# EAGLE design K-Diag small- single_small-multi (EAGLE 6.5.0)

## Sheet 1 of 3
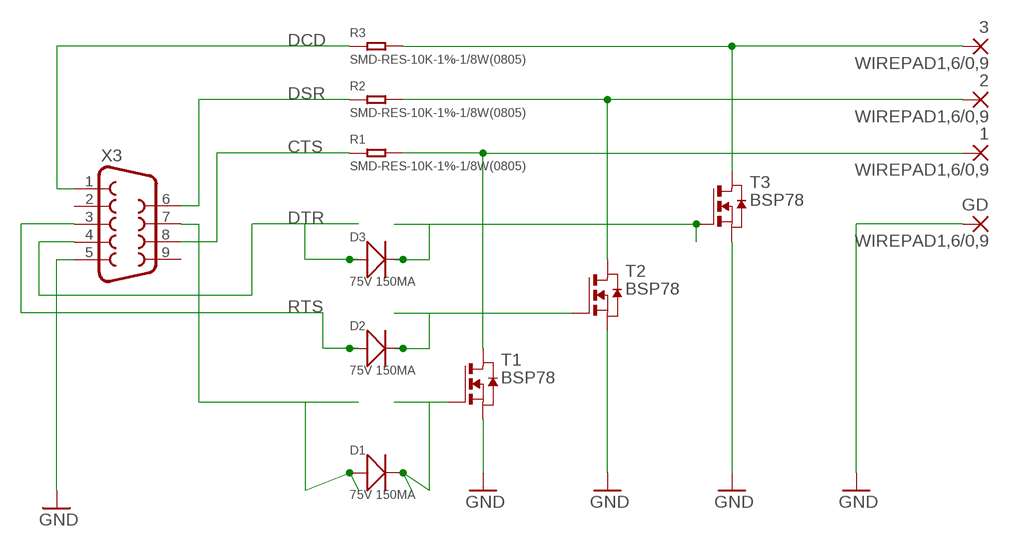
[diagram p0: schematic, sheet 1]

### Parts
1  WIREPAD1,6/0,9  [1,6/0,9]
2  WIREPAD1,6/0,9  [1,6/0,9]
3  WIREPAD1,6/0,9  [1,6/0,9]
D1  75V 150MA  SMD-DIODE-SWITCHING-75V-150MA(D1206)  [LED-1206]
D2  75V 150MA  SMD-DIODE-SWITCHING-75V-150MA(D1206)  [LED-1206]
D3  75V 150MA  SMD-DIODE-SWITCHING-75V-150MA(D1206)  [LED-1206]
GD  WIREPAD1,6/0,9  [1,6/0,9]
R1  SMD-RES-10K-1%-1/8W(0805)  [R0805]
R2  SMD-RES-10K-1%-1/8W(0805)  [R0805]
R3  SMD-RES-10K-1%-1/8W(0805)  [R0805]
T1  BSP78  NMOSSOT223  [SOT223]
T2  BSP78  NMOSSOT223  [SOT223]
T3  BSP78  NMOSSOT223  [SOT223]
X3  F09D  [F09D]

### Nets
CTS: R1.1 X3.8 ; also sheet 2,3
DCD: R3.1 X3.1 ; also sheet 2,3
DSR: R2.1 X3.6 ; also sheet 2,3
DTR: D3.+ X3.4 ; also sheet 2,3
GND: GD.1(P) T1.3(S) T2.3(S) T3.3(S) X3.5 ; also sheet 2,3
N$1: D3.- T3.1(G)
N$2: D2.- T2.1(G)
N$3: D1.- T1.1(G)
N$4: 1.1(P) R1.2 T1.2(D) T1.4(D)
N$5: 2.1(P) R2.2 T2.2(D) T2.4(D)
N$6: 3.1(P) R3.2 T3.2(D) T3.4(D)
N$7: D1.+ X3.7
RTS: D2.+ X3.3 ; also sheet 2,3
Unconnected: X3.2 X3.9

## Sheet 2 of 3
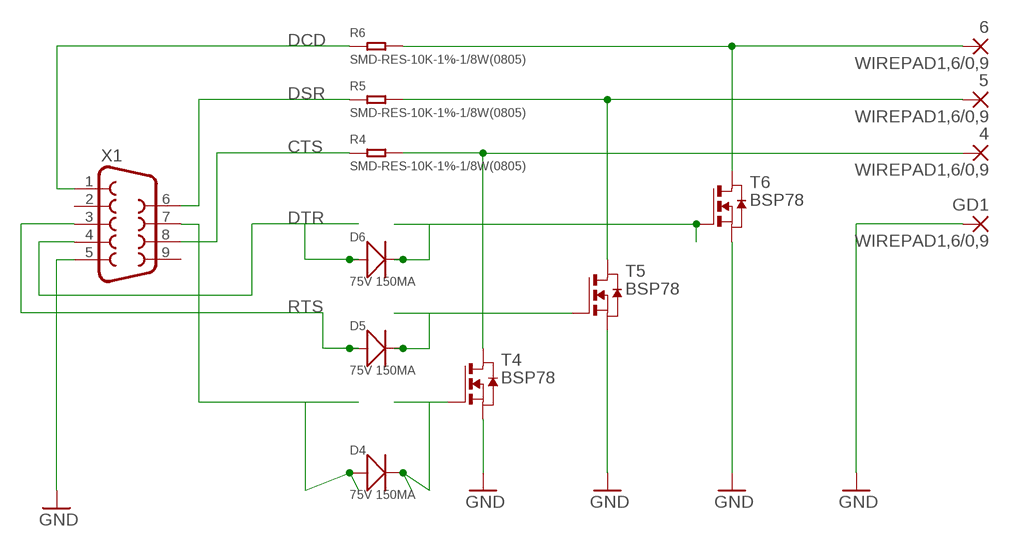
[diagram p1: schematic, sheet 2]

### Parts
4  WIREPAD1,6/0,9  [1,6/0,9]
5  WIREPAD1,6/0,9  [1,6/0,9]
6  WIREPAD1,6/0,9  [1,6/0,9]
D4  75V 150MA  SMD-DIODE-SWITCHING-75V-150MA(D1206)  [LED-1206]
D5  75V 150MA  SMD-DIODE-SWITCHING-75V-150MA(D1206)  [LED-1206]
D6  75V 150MA  SMD-DIODE-SWITCHING-75V-150MA(D1206)  [LED-1206]
GD1  WIREPAD1,6/0,9  [1,6/0,9]
R4  SMD-RES-10K-1%-1/8W(0805)  [R0805]
R5  SMD-RES-10K-1%-1/8W(0805)  [R0805]
R6  SMD-RES-10K-1%-1/8W(0805)  [R0805]
T4  BSP78  NMOSSOT223  [SOT223]
T5  BSP78  NMOSSOT223  [SOT223]
T6  BSP78  NMOSSOT223  [SOT223]
X1  F09D  [F09D]

### Nets
CTS: R4.1 X1.8 ; also sheet 1,3
DCD: R6.1 X1.1 ; also sheet 1,3
DSR: R5.1 X1.6 ; also sheet 1,3
DTR: D6.+ X1.4 ; also sheet 1,3
GND: GD1.1(P) T4.3(S) T5.3(S) T6.3(S) X1.5 ; also sheet 1,3
N$8: D6.- T6.1(G)
N$9: D5.- T5.1(G)
N$10: D4.- T4.1(G)
N$11: 4.1(P) R4.2 T4.2(D) T4.4(D)
N$12: 5.1(P) R5.2 T5.2(D) T5.4(D)
N$13: 6.1(P) R6.2 T6.2(D) T6.4(D)
N$14: D4.+ X1.7
RTS: D5.+ X1.3 ; also sheet 1,3
Unconnected: X1.2 X1.9

## Sheet 3 of 3
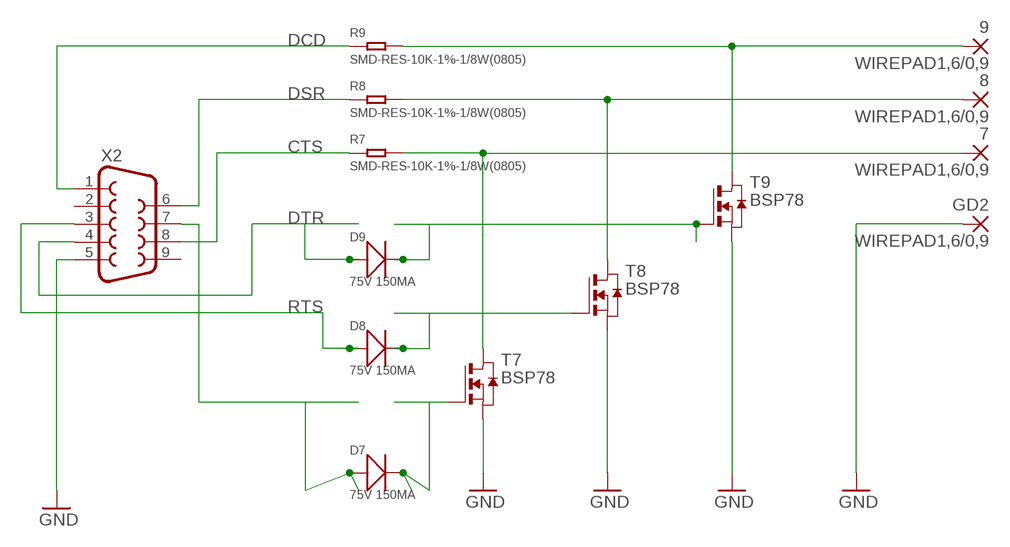
[diagram p2: schematic, sheet 3]

### Parts
7  WIREPAD1,6/0,9  [1,6/0,9]
8  WIREPAD1,6/0,9  [1,6/0,9]
9  WIREPAD1,6/0,9  [1,6/0,9]
D7  75V 150MA  SMD-DIODE-SWITCHING-75V-150MA(D1206)  [LED-1206]
D8  75V 150MA  SMD-DIODE-SWITCHING-75V-150MA(D1206)  [LED-1206]
D9  75V 150MA  SMD-DIODE-SWITCHING-75V-150MA(D1206)  [LED-1206]
GD2  WIREPAD1,6/0,9  [1,6/0,9]
R7  SMD-RES-10K-1%-1/8W(0805)  [R0805]
R8  SMD-RES-10K-1%-1/8W(0805)  [R0805]
R9  SMD-RES-10K-1%-1/8W(0805)  [R0805]
T7  BSP78  NMOSSOT223  [SOT223]
T8  BSP78  NMOSSOT223  [SOT223]
T9  BSP78  NMOSSOT223  [SOT223]
X2  F09D  [F09D]

### Nets
CTS: R7.1 X2.8 ; also sheet 1,2
DCD: R9.1 X2.1 ; also sheet 1,2
DSR: R8.1 X2.6 ; also sheet 1,2
DTR: D9.+ X2.4 ; also sheet 1,2
GND: GD2.1(P) T7.3(S) T8.3(S) T9.3(S) X2.5 ; also sheet 1,2
N$15: D9.- T9.1(G)
N$16: D8.- T8.1(G)
N$17: D7.- T7.1(G)
N$18: 7.1(P) R7.2 T7.2(D) T7.4(D)
N$19: 8.1(P) R8.2 T8.2(D) T8.4(D)
N$20: 9.1(P) R9.2 T9.2(D) T9.4(D)
N$21: D7.+ X2.7
RTS: D8.+ X2.3 ; also sheet 1,2
Unconnected: X2.2 X2.9

## Library data of the parts
1-9 GD GD1 GD2 = wirepad:WIREPAD: Wire PAD connect wire on PCB
D1-D9 = Seeed-Diode-2016:SMD-DIODE-SWITCHING-75V-150MA(D1206): 304040005; MPN: CD1206-S01575
R1-R9 = Seeed-Resistor-2016:SMD-RES-10K-1%-1/8W(0805): 301010361; MPN: RC0805FR-0710KL; VALUE: 10K
T1-T9 = zetex_nmos_BSP78:NMOSSOT223: MOS FET; OC_FARNELL: unknown; OC_NEWARK: unknown
X1-X3 = con-subd_Kdiag:F09: SUB-D; OC_FARNELL: unknown; OC_NEWARK: unknown

## Board
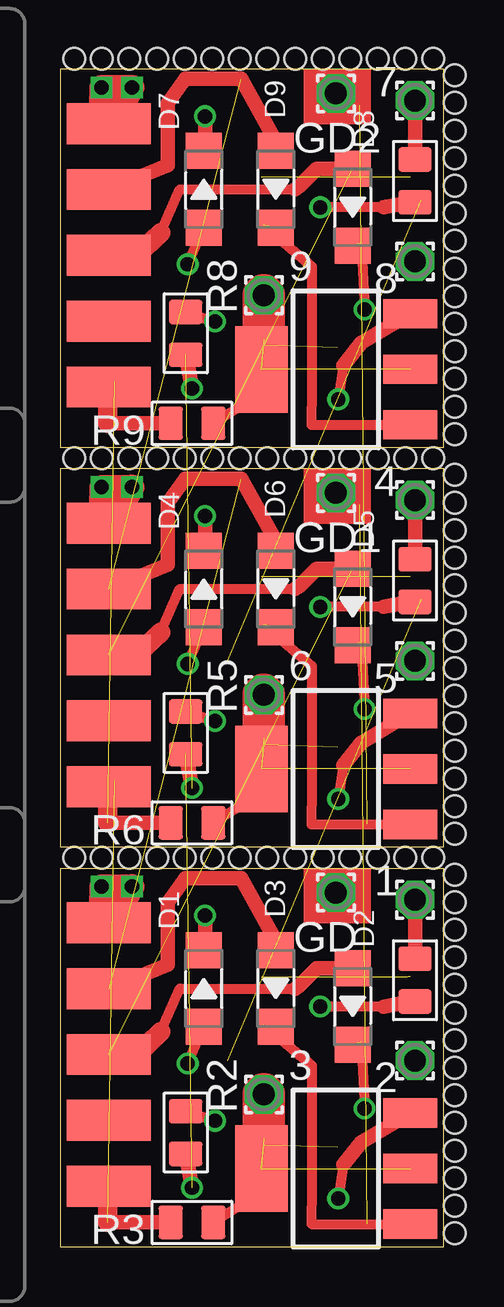
[diagram p3: board, top side]
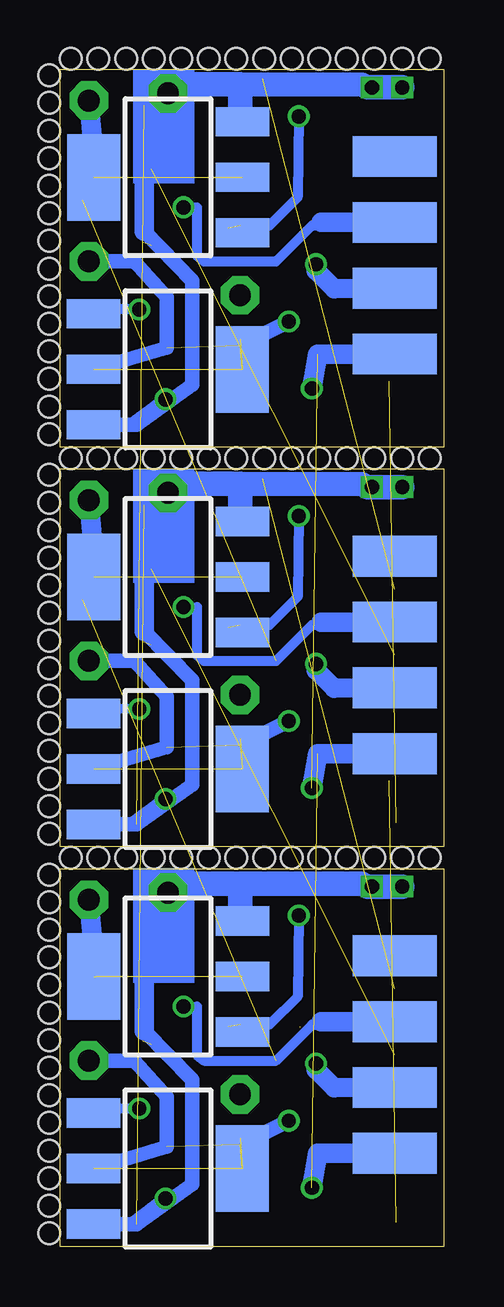
[diagram p4: board, bottom side, seen from below]

Size 15.99 x 49.05 mm. Coordinates in mm from the lower left corner, seen from the top.
Outline: 0,0 15.99,0 15.99,15.75 0,15.75 0,0
Outline: 0,16.65 15.99,16.65 15.99,32.4 0,32.4 0,16.65
Outline: 0,33.3 15.99,33.3 15.99,49.05 0,49.05 0,33.3
Copper layers (1*16): Top 0.035mm / dielectric 1.5mm / Bottom 0.035mm
Design rules "SeeedStudio_2layer_DRU_no_angle_20140221 *": minimum track width 6mil, minimum drill 12mil, track to track 6mil, track to pad 12mil, pad to pad 6mil, via to via 6mil, smd to smd 0mil, copper to edge 10mil, drill to drill 10mil, minimum pad ring 10mil, minimum via ring 6mil, stop-mask expansion 2mil, vias tented up to drill 100mil, thermal gap 10mil
Holes 0.9 mm at 16.44,0.55 16.44,1.7 16.44,2.85 16.44,4 16.44,5.15 16.44,6.3 16.44,7.45 16.44,8.6 16.44,9.75 16.44,10.9 16.44,12.05 16.44,13.2 16.44,14.35 16.44,15.5 0.59,16.2 0.59,16.2 1.74,16.2 2.89,16.2 4.04,16.2 5.19,16.2 6.34,16.2 7.49,16.2 8.64,16.2 9.79,16.2 10.94,16.2 12.09,16.2 13.24,16.2 14.39,16.2 15.54,16.2 16.44,17.2 16.44,18.35 16.44,19.5 16.44,20.65 16.44,21.8 16.44,22.95 16.44,24.1 16.44,25.25 16.44,26.4 16.44,27.55 16.44,28.7 16.44,29.85 16.44,31 16.44,32.15 0.59,32.85 0.59,32.85 1.74,32.85 2.89,32.85 4.04,32.85 5.19,32.85 6.34,32.85 7.49,32.85 8.64,32.85 9.79,32.85 10.94,32.85 12.09,32.85 13.24,32.85 14.39,32.85 15.54,32.85 16.44,33.85 16.44,35 16.44,36.15 16.44,37.3 16.44,38.45 16.44,39.6 16.44,40.75 16.44,41.9 16.44,43.05 16.44,44.2 16.44,45.35 16.44,46.5 16.44,47.65 16.44,48.8 0.59,49.5 0.59,49.5 1.74,49.5 2.89,49.5 4.04,49.5 5.19,49.5 6.34,49.5 7.49,49.5 8.64,49.5 9.79,49.5 10.94,49.5 12.09,49.5 13.24,49.5 14.39,49.5 15.54,49.5

### Footprints (pad centres in the part's own frame; a part is rotated, then mirrored left to right if it is on the bottom)
1,6/0,9 = drill 0.914 pad 1.6 octagon: 1 0,0
LED-1206 = smd 1.5 x 1.5: + -1.6,0; - 1.6,0
R0805 = smd 1.397 x 1.016: 1 0,0.889; 2 0,-0.889
SOT223 = smd 1.219 x 2.235: 1 -2.311,-3.099; 2 0,-3.099; 3 2.311,-3.099 | smd 3.6 x 2.2: 4 0,3.099
F09D = smd 1.7 x 3.5: 1 -5.486,-6.045; 2 -2.743,-6.045; 3 0,-6.045; 4 2.743,-6.045; 5 5.486,-6.045 | smd 1.7 x 3.5 bottom: 6 -4.115,-6.045; 7 -1.372,-6.045; 8 1.372,-6.045; 9 4.115,-6.045

### Placement (x,y rotation side)
1  14.79,14.45 0 top
2  14.79,7.75 0 top
3  8.49,6.34 0 top
4  14.79,31.1 0 top
5  14.79,24.4 0 top
6  8.49,22.99 0 top
7  14.79,47.75 0 top
8  14.79,41.05 0 top
9  8.49,39.64 0 top
D1  5.99,10.75 90 top
D2  12.19,10 270 top
D3  8.99,10.75 270 top
D4  5.99,27.4 90 top
D5  12.19,26.65 270 top
D6  8.99,27.4 270 top
D7  5.99,44.05 90 top
D8  12.19,43.3 270 top
D9  8.99,44.05 270 top
GD  11.49,14.75 0 top
GD1  11.49,31.4 0 top
GD2  11.49,48.05 0 top
R1  14.79,11.1 180 top
R2  5.24,4.75 180 top
R3  5.5,1 90 top
R4  14.79,27.75 180 top
R5  5.24,21.4 180 top
R6  5.5,17.65 90 top
R7  14.79,44.4 180 top
R8  5.24,38.05 180 top
R9  5.5,34.3 90 top
T1  11.49,11.25 90 bottom
T2  11.49,3.25 270 bottom
T3  11.49,3.25 90 top
T4  11.49,27.9 90 bottom
T5  11.49,19.9 270 bottom
T6  11.49,19.9 90 top
T7  11.49,44.55 90 bottom
T8  11.49,36.55 270 bottom
T9  11.49,36.55 90 top
X1  -4.01,24.65 90 top
X2  -4.01,41.3 90 top
X3  -4.01,8 90 top

### Tracks (layer width: path | path; a pad name or v marks a point on that pad's centre or on a via)
CTS  (via drill 0.6)  (2 unrouted)
  Top 0.406: 13.49,10 v10.84,10 | 13.49,26.65 v10.84,26.65 | 13.49,43.3 v10.84,43.3
  Top 0.61: R1.1 15.04,10.3 13.49,10 | R4.1 15.04,26.95 13.49,26.65 | R7.1 15.04,43.6 13.49,43.3
  Bottom 0.406: v10.84,10 10.29,10 10.29,8 9.99,7.75 6.99,7.75 5.49,9.25 5.24,9.25 5.11,9.37 | v10.84,26.65 10.29,26.65 10.29,24.65 9.99,24.4 6.99,24.4 5.49,25.9 5.24,25.9 5.11,26.02 | v10.84,43.3 10.29,43.3 10.29,41.3 9.99,41.05 6.99,41.05 5.49,42.55 5.24,42.55 5.11,42.67
  Bottom 0.813: X3.8 5.11,9.37 | X1.8 5.11,26.02 | X2.8 5.11,42.67
DCD  (2 unrouted)
  Top 0.406: 2.27,2.75 X3.1 | 2.27,19.4 X1.1 | 2.27,36.05 X2.1
  Top 0.61: R3.1 1.99,1 | R6.1 1.99,17.65 | R9.1 1.99,34.3
  Top 0.813: 1.99,1 1.99,2.25 2.27,2.75 | 1.99,17.65 1.99,18.9 2.27,19.4 | 1.99,34.3 1.99,35.55 2.27,36.05
DSR  (via drill 0.6)  (2 unrouted)
  Top 0.61: v5.5,2.45 R2.1 | v5.5,19.1 R5.1 | v5.5,35.75 R8.1
  Bottom 0.813: X3.6 5.25,3.88 v5.5,2.45 | X1.6 5.25,20.54 v5.5,19.1 | X2.6 5.25,37.19 v5.5,35.75
DTR  (2 unrouted)
  Top 0.406: 2.04,10.75 X3.4 | 2.04,27.4 X1.4 | 2.04,44.05 X2.4
  Top 0.61: 2.04,10.75 4.49,11.75 4.49,14.33 5.22,15.35 7.54,15.35 8.99,12.75 D3.+ | 2.04,27.4 4.49,28.4 4.49,30.98 5.22,32 7.54,32 8.99,29.4 D6.+ | 2.04,44.05 4.49,45.05 4.49,47.63 5.22,48.65 7.54,48.65 8.99,46.05 D9.+
GND  (via drill 0.6)  (2 unrouted)
  Top 0.406: X3.5 2.23,13.49 | 11.79,3.4 v11.59,2 | X1.5 2.23,30.14 | 11.79,20.05 v11.59,18.65 | X2.5 2.23,46.79 | 11.79,36.7 v11.59,35.3
  Top 0.61: T3.3 12.54,4.35 11.79,3.4 | T6.3 12.54,21 11.79,20.05 | T9.3 12.54,37.65 11.79,36.7
  Top 1.016: 2.73,13.49 2.23,13.49 v3,15 | 2.99,15.01 v1.73,15 1.72,14.25 | 2.73,30.14 2.23,30.14 v3,31.65 | 2.99,31.66 v1.73,31.65 1.72,30.9 | 2.73,46.79 2.23,46.79 v3,48.3 | 2.99,48.31 v1.73,48.3 1.72,47.55
  Bottom 0.61: T2.3 12.99,0.94 | 12.99,0.94 12.8,0.94 10.49,2.6 10.49,6.95 12.49,9 | v11.59,2 v11.59,1.99 12.99,0.94 | T5.3 12.99,17.59 | 12.99,17.59 12.8,17.59 10.49,19.25 10.49,23.6 12.49,25.65 | v11.59,18.65 11.59,18.64 12.99,17.59 | T8.3 12.99,34.24 | 12.99,34.24 12.8,34.24 10.49,35.9 10.49,40.25 12.49,42.3 | v11.59,35.3 v11.59,35.29 12.99,34.24
  Bottom 0.813: 12.49,9 12.49,14.25 GD.1 | 12.49,25.65 12.49,30.9 GD1.1 | 12.49,42.3 12.49,47.55 GD2.1
  Bottom 1.016: 8.49,15.12 3.42,15.12 3.17,15 v3,15 v1.73,15 | T1.3 8.49,13.56 8.49,15.12 | 8.49,15.12 10.99,15.12 GD.1 | 8.49,31.77 3.42,31.77 3.17,31.65 v3,31.65 v1.73,31.65 | T4.3 8.49,30.21 8.49,31.77 | 8.49,31.77 10.99,31.77 GD1.1 | 8.49,48.42 3.42,48.42 3.17,48.3 v3,48.3 v1.73,48.3 | T7.3 8.49,46.86 8.49,48.42 | 8.49,48.42 10.99,48.42 GD2.1
N$1  (1 unrouted)
  Top 0.406: 8.49,9.25 10.49,7.54 10.49,2.47 10.48,0.94 T3.1
N$2  (via drill 0.6)  (1 unrouted)
  Top 0.406: 12.54,8.55 v12.69,5.75
  Bottom 0.406: v12.69,5.75 14.4,5.75 T2.1
N$3  (via drill 0.6)
  Top 0.61: v6.04,13.79 6.04,12.8 D1.-
  Bottom 0.406: v6.04,13.79 6.09,10.42 7.25,9.25 8.21,9.25 T1.1
N$4  (2 unrouted)
  Top 0.61: R1.2 1.1
  Bottom 0.813: 14.49,11.25 1.1
N$5  (via drill 0.6)  (2 unrouted)
  Top 0.406: R2.2 v6.46,5.24
  Bottom 0.61: v6.46,5.24 8.49,4.25 | 2.1 12.89,7.75 11.54,6.25 11.54,4.15 T2.2
N$6  (2 unrouted)
  Top 0.406: R3.2 7.99,2.01
  Top 0.61: 7.99,2.01 8.49,4.5
  Top 1.778: 3.1 8.49,4.5
N$7  (via drill 0.6)  (1 unrouted)
  Top 0.406: v5.32,7.63 5.99,9.13 5.99,9.25
  Bottom 0.813: X3.7 4.56,6.61 5.32,7.36 v5.32,7.63
N$8  (1 unrouted)
  Top 0.406: 8.49,25.9 10.49,24.19 10.49,19.12 10.48,17.59 T6.1
N$9  (via drill 0.6)  (1 unrouted)
  Top 0.406: 12.54,25.2 v12.69,22.4
  Bottom 0.406: v12.69,22.4 14.4,22.4 T5.1
N$10  (via drill 0.6)
  Top 0.61: v6.04,30.44 6.04,29.45 D4.-
  Bottom 0.406: v6.04,30.44 6.09,27.07 7.25,25.9 8.21,25.9 T4.1
N$11  (2 unrouted)
  Top 0.61: R4.2 4.1
  Bottom 0.813: 14.49,27.9 4.1
N$12  (via drill 0.6)  (2 unrouted)
  Top 0.406: R5.2 v6.46,21.89
  Bottom 0.61: v6.46,21.89 8.49,20.9 | 5.1 12.89,24.4 11.54,22.9 11.54,20.8 T5.2
N$13  (2 unrouted)
  Top 0.406: R6.2 7.99,18.66
  Top 0.61: 7.99,18.66 8.49,21.15
  Top 1.778: 6.1 8.49,21.15
N$14  (via drill 0.6)  (1 unrouted)
  Top 0.406: v5.32,24.28 5.99,25.78 5.99,25.9
  Bottom 0.813: X1.7 4.56,23.26 5.32,24.01 v5.32,24.28
N$15  (1 unrouted)
  Top 0.406: 8.49,42.55 10.49,40.84 10.49,35.77 10.48,34.24 T9.1
N$16  (via drill 0.6)  (1 unrouted)
  Top 0.406: 12.54,41.85 v12.69,39.05
  Bottom 0.406: v12.69,39.05 14.4,39.05 T8.1
N$17  (via drill 0.6)
  Top 0.61: v6.04,47.09 6.04,46.1 D7.-
  Bottom 0.406: v6.04,47.09 6.09,43.72 7.25,42.55 8.21,42.55 T7.1
N$18  (2 unrouted)
  Top 0.61: R7.2 7.1
  Bottom 0.813: 14.49,44.55 7.1
N$19  (via drill 0.6)  (2 unrouted)
  Top 0.406: R8.2 v6.46,38.54
  Bottom 0.61: v6.46,38.54 8.49,37.55 | 8.1 12.89,41.05 11.54,39.55 11.54,37.45 T8.2
N$20  (2 unrouted)
  Top 0.406: R9.2 7.99,35.31
  Top 0.61: 7.99,35.31 8.49,37.8
  Top 1.778: 9.1 8.49,37.8
N$21  (via drill 0.6)  (1 unrouted)
  Top 0.406: v5.32,40.93 5.99,42.43 5.99,42.55
  Bottom 0.813: X2.7 4.56,39.91 5.32,40.66 v5.32,40.93
RTS  (2 unrouted)
  Top 0.406: 4.19,8.95 4.99,10.75 9.79,10.75 | 4.19,25.6 4.99,27.4 9.79,27.4 | 4.19,42.25 4.99,44.05 9.79,44.05
  Top 0.61: 9.79,10.75 9.94,10.85 10.69,11.6 D2.+ | 9.79,27.4 9.94,27.5 10.69,28.25 D5.+ | 9.79,44.05 9.94,44.15 10.69,44.9 D8.+
  Top 0.813: X3.3 3.19,8 4.19,8.95 | X1.3 3.19,24.65 4.19,25.6 | X2.3 3.19,41.3 4.19,42.25
(copper drawn outside any net)
  shapes: Bottom area x3, Top area x3